# Altium schematic sheet NguyenLy.SchDoc
size A3; SheetNumber: 1; SheetTotal: 1
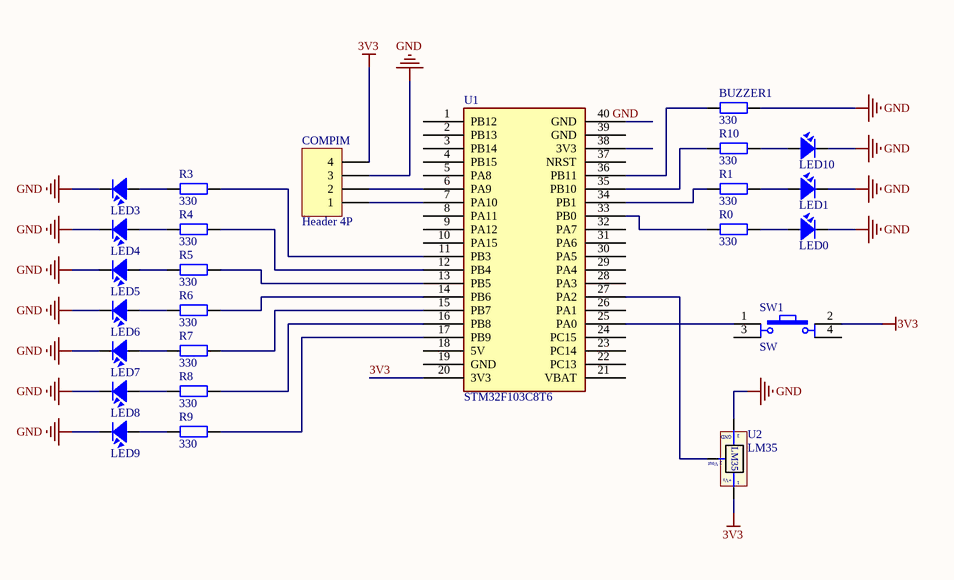
[diagram p0: NguyenLy.SchDoc]

## Parts
BUZZER1  330  [R1/4W]
COMPIM  Header 4P  [HDR1X4]
LED0  LED  [LED-3]  (value not drawn)
LED1  LED  [LED-3]  (value not drawn)
LED3  LED  [LED-3]  (value not drawn)
LED4  LED  [LED-3]  (value not drawn)
LED5  LED  [LED-3]  (value not drawn)
LED6  LED  [LED-3]  (value not drawn)
LED7  LED  [LED-3]  (value not drawn)
LED8  LED  [LED-3]  (value not drawn)
LED9  LED  [LED-3]  (value not drawn)
LED10  LED  [LED-3]  (value not drawn)
R0  330  [R1/4W]
R1  330  [R1/4W]
R3  330  [R1/4W]
R4  330  [R1/4W]
R5  330  [R1/4W]
R6  330  [R1/4W]
R7  330  [R1/4W]
R8  330  [R1/4W]
R9  330  [R1/4W]
R10  330  [R1/4W]
SW1  SW  [SW4]
U1  STM32F103C8T6  [Stm32 BluePill]
U2  LM35  [QTO-92]

## Nets
3V3: COMPIM.4 SW1.2 U1.20(3V3) U2.1(+Vs)
GND: BUZZER1.1 COMPIM.3 LED0.2 LED1.2 LED3.2 LED4.2 LED5.2 LED6.2 LED7.2 LED8.2 LED9.2 LED10.2 U2.3(-)
NetBUZZER1_2: BUZZER1.2 U1.36(PB11)
NetCOMPIM_1: COMPIM.1 U1.7(PA10)
NetCOMPIM_2: COMPIM.2 U1.6(PA9)
NetLED0_1: LED0.1 R0.1
NetLED1_1: LED1.1 R1.1
NetLED3_1: LED3.1 R3.1
NetLED4_1: LED4.1 R4.1
NetLED5_1: LED5.1 R5.1
NetLED6_1: LED6.1 R6.1
NetLED7_1: LED7.1 R7.1
NetLED8_1: LED8.1 R8.1
NetLED9_1: LED9.1 R9.1
NetLED10_1: LED10.1 R10.1
NetR0_2: R0.2 U1.33(PB0)
NetR1_2: R1.2 U1.34(PB1)
NetR3_2: R3.2 U1.11(PB3)
NetR4_2: R4.2 U1.12(PB4)
NetR5_2: R5.2 U1.13(PB5)
NetR6_2: R6.2 U1.14(PB6)
NetR7_2: R7.2 U1.15(PB7)
NetR8_2: R8.2 U1.16(PB8)
NetR9_2: R9.2 U1.17(PB9)
NetR10_2: R10.2 U1.35(PB10)
NetSW1_1: SW1.1 U1.25(PA0)
NetU1_27: U1.27(PA2) U2.2(Vout)

Not connected (* = marked no-connect by the designer): SW1 3 4; U1 1(PB12) 2(PB13) 3(PB14) 4(PB15) 5(PA8) 8(PA11) 9(PA12) 10(PA15) 18(5V) 19(GND) 21(VBAT) 22(PC13) 23(PC14) 24(PC15) 26(PA1) 28(PA3) 29(PA4) 30(PA5) 31(PA6) 32(PA7) 37(NRST) 38(3V3) 39(GND) 40(GND)

## Notes on the sheet
- Labels drawn without touching a wire or pin: GND
- (in symbol LM35) GND

## Library data of the parts
BUZZER1 R0 R1 R3-R10 = R1/4W: Resistor 1/4W; Value: R1/4W - 1K
COMPIM = Header 4x1: Header, 4 Pin Pitch 2.54mm; MPN: S1012EC-40-ND; CompanyID: VT-00125; Solder: WAVE; Value: Header 4P
LED0 LED1 LED3-LED10 = LED: LED Single colour Green and Red; Value: LED 3 ly Single Colour
SW1 = SW4: Switch button 4 pin; Value: Button chip 4 pin
U1 = BluePill: Designed By @Alixahedi
U2 = LM35: Teminal; Value: LM35